# Altium schematic sheet Sheet1.SchDoc
size A4; SheetNumber: 1; SheetTotal: 1; SPICEModelCacheLHBWUHTN: <root> / <DocumentId>LHBWUHTN</DocumentId> / </root>
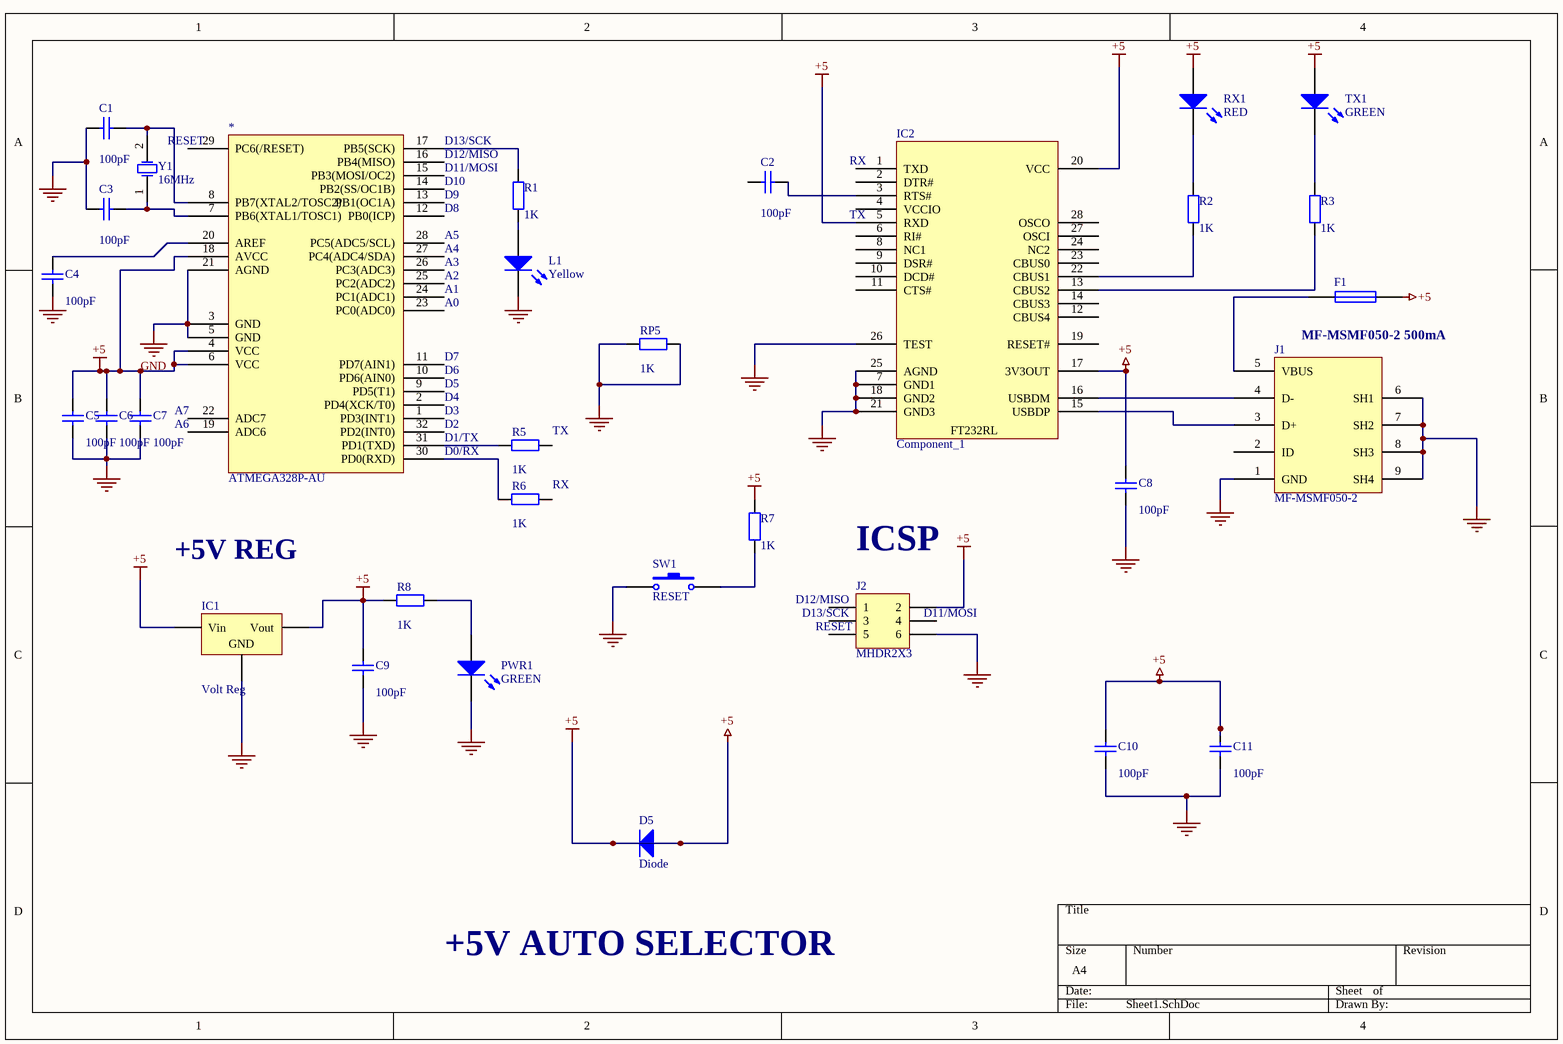
[diagram p0: Sheet1.SchDoc]

## Parts
*  ATMEGA328P-AU  [SOIC127P980X95_HS-33N]
C1  value 100pF  [RAD-0.3]  (hidden comment: Cap)
C2  value 100pF  [RAD-0.3]  (hidden comment: Cap)
C3  value 100pF  [RAD-0.3]  (hidden comment: Cap)
C4  value 100pF  [RAD-0.3]  (hidden comment: Cap)
C5  value 100pF  [RAD-0.3]  (hidden comment: Cap)
C6  value 100pF  [RAD-0.3]  (hidden comment: Cap)
C7  value 100pF  [RAD-0.3]  (hidden comment: Cap)
C8  value 100pF  [RAD-0.3]  (hidden comment: Cap)
C9  value 100pF  [RAD-0.3]  (hidden comment: Cap)
C10  value 100pF  [RAD-0.3]  (hidden comment: Cap)
C11  value 100pF  [RAD-0.3]  (hidden comment: Cap)
D5  Diode  [SMC]
F1  Fuse 1  [PIN-W2/E2.8]  (value not drawn)
IC1  Volt Reg  [D2PAK_N]
IC2  Component_1  [SOIC127P980X95_HS-29N]
J1  MF-MSMF050-2  [SOIC127P980X95_HS-10N]
J2  MHDR2X3  [MHDR2X3]
L1  Yellow  [3.2X1.6X1.1]
PWR1  GREEN  [3.2X1.6X1.1]
R1  value 1K  [AXIAL-0.4]  (hidden comment: Res2)
R2  value 1K  [AXIAL-0.4]  (hidden comment: Res2)
R3  value 1K  [AXIAL-0.4]  (hidden comment: Res2)
R5  value 1K  [AXIAL-0.4]  (hidden comment: Res2)
R6  value 1K  [AXIAL-0.4]  (hidden comment: Res2)
R7  value 1K  [AXIAL-0.4]  (hidden comment: Res2)
R8  value 1K  [AXIAL-0.4]  (hidden comment: Res2)
RP5  value 1K  [AXIAL-0.4]  (hidden comment: Res2)
RX1  RED  [3.2X1.6X1.1]
SW1  RESET  [SPST-2]
TX1  GREEN  [3.2X1.6X1.1]
Y1  16MHz  [R38]

## Nets
+5: *.4(VCC) *.6(VCC) *.18(AVCC) C5.2 C6.2 C7.2 C8.2 C9.2 C10.2 C11.2 D5.1(A) D5.2(K) F1.2 IC1.1(Vin) IC1.3(Vout) IC2.5(RXD) IC2.17(3V3OUT) IC2.20(VCC) J2.2 R7.2 R8.1 RX1.1(A) TX1.1(A)
GND: *.3(GND) *.5(GND) *.21(AGND) C1.1 C3.1 C4.1 C5.1 C6.1 C7.1 C8.1 C9.1 C10.1 C11.1 IC1.2(GND) IC2.7(GND1) IC2.18(GND2) IC2.21(GND3) IC2.25(AGND) IC2.26(TEST) J1.1(GND) J1.6(SH1) J1.7(SH2) J1.8(SH3) J1.9(SH4) J2.6 L1.2(K) PWR1.2(K) RP5.1 RP5.2 SW1.1
Net*_7: *.7(PB6(XTAL1/TOSC1)) C3.2 Y1.1(OSC1)
Net*_8: *.8(PB7(XTAL2/TOSC2)) C1.2 Y1.2(OSC2)
Net*_17: *.17(PB5(SCK)) R1.2
Net*_20: *.20(AREF) C4.2
Net*_30: *.30(PD0(RXD)) R6.2
Net*_31: *.31(PD1(TXD)) R5.2
NetC2_2: C2.2 IC2.3(RTS#)
NetF1_1: F1.1 J1.5(VBUS)
NetIC2_13: IC2.13(CBUS2) R3.1
NetIC2_15: IC2.15(USBDP) J1.3(D+)
NetIC2_16: IC2.16(USBDM) J1.4(D-)
NetIC2_22: IC2.22(CBUS1) R2.1
NetL1_1: L1.1(A) R1.1
NetPWR1_1: PWR1.1(A) R8.2
NetR2_2: R2.2 RX1.2(K)
NetR3_2: R3.2 TX1.2(K)
NetR7_1: R7.1 SW1.2

Not connected (* = marked no-connect by the designer): * 1(PD3(INT1)) 2(PD4(XCK/T0)) 9(PD5(T1)) 10(PD6(AIN0)) 11(PD7(AIN1)) 12(PB0(ICP)) 13(PB1(OC1A)) 14(PB2(SS/OC1B)) 15(PB3(MOSI/OC2)) 16(PB4(MISO)) 19(ADC6) 22(ADC7) 23(PC0(ADC0)) 24(PC1(ADC1)) 25(PC2(ADC2)) 26(PC3(ADC3)) 27(PC4(ADC4/SDA)) 28(PC5(ADC5/SCL)) 29(PC6(/RESET)) 32(PD2(INT0)); C2 1; IC2 1(TXD) 2(DTR#) 4(VCCIO) 6(RI#) 8(NC1) 9(DSR#) 10(DCD#) 11(CTS#) 12(CBUS4) 14(CBUS3) 19(RESET#) 23(CBUS0) 24(NC2) 27(OSCI) 28(OSCO); J1 2(ID); J2 1 3 4 5; R5 1; R6 1

## Notes on the sheet
- RESET
- D13/SCK
- D12/MISO
- D11/MOSI
- D10
- (near IC2) RX
- D9
- D8
- A5
- A4
- (near IC2) TX
- A3
- A2
- A1
- (near *) A0
- (near *) D7
- (near *) D6
- (near *) D5
- MF-MSMF050-2 500mA
- A6
- A7
- (near *) D4
- D3
- D2
- D1/TX
- D0/RX
- (near R5) TX
- (near R6) RX
- +5V REG
- (near J2) ICSP
- (near J2) D12/MISO
- (near J2) D13/SCK
- (near J2) RESET
- (near J2) D11/MOSI
- +5V AUTO SELECTOR
- (in symbol Component_1) FT232RL

## Library data of the parts
C1-C11 = Cap: Capacitor; Published: 8-Jun-2000; LatestRevisionDate: 17-Jul-2002; LatestRevisionNote: Re-released for DXP Platform.; PackageReference: RAD-0.3; Publisher: Altium Limited; PackageDescription: Radial Cap, Thru-Hole; 2 Leads; 0.3 in Pin Spacing
D5 = Diode: Default Diode; Published: 8-Jun-2000; LatestRevisionDate: 17-Jul-2002; LatestRevisionNote: Re-released for DXP Platform.; PackageVersion: Sep-1996; PackageReference: SMC; Publisher: Altium Limited; PackageDescription: DO-214-AB/SMC; 2 C-Bend Leads; Body 7.9 x 5.9 mm, inc. leads (LxW); Code_JEDEC: DO-214-AB
F1 = Fuse 1: Fuse; Published: 8-Jun-2000; LatestRevisionDate: 17-Jul-2002; LatestRevisionNote: Re-released for DXP Platform.; PackageReference: PIN-W2/E2.8; Publisher: Altium Limited; PackageDescription: Thru-Hole; 2 Leads
IC1 = Volt Reg: Voltage Regulator; Published: 24-Mar-1999; LatestRevisionDate: 29-May-2009; LatestRevisionNote: IPC-7351 Footprint Added.; PackageReference: D2PAK; Publisher: Altium Limited; PackageDescription: 3-Pin Transistor Outline Package 2.54 mm Pitch, 15.1 mm Lead Span
J2 = MHDR2X3: Header, 3-Pin, Dual row; LatestRevisionDate: 17-Jul-2002; LatestRevisionNote: Re-released for DXP Platform.; Publisher: Altium Limited
L1 PWR1 RX1 TX1 = LED2: Typical RED, GREEN, YELLOW, AMBER GaAs LED; Published: 8-Jun-2000; LatestRevisionDate: 17-Jul-2002; LatestRevisionNote: Re-released for DXP Platform.; PackageVersion: Feb-2002; PackageReference: 3.2X1.6X1.1; Publisher: Altium Limited; PackageDescription: SM LED; 2 Flat Leads
R1-R3 R5-R8 RP5 = Res2: Resistor; Published: 8-Jun-2000; LatestRevisionDate: 17-Jul-2002; LatestRevisionNote: Re-released for DXP Platform.; PackageReference: AXIAL-0.4; Publisher: Altium Limited; PackageDescription: Axial Device, Thru-Hole; 2 Leads; 0.4 in Pin Spacing
SW1 = SW-PB: Switch; Published: 24-Mar-1999; LatestRevisionDate: 17-Jul-2002; LatestRevisionNote: Re-released for DXP Platform.; PackageReference: SPST-2; Publisher: Altium Limited; PackageDescription: Switch; 2 Leads
Y1 = XTAL: Crystal Oscillator; Published: 8-Jun-2000; LatestRevisionDate: 17-Jul-2002; LatestRevisionNote: Re-released for DXP Platform.; PackageReference: R38; Publisher: Altium Limited; PackageDescription: Crystal, Thru-Hole; 2 Leads; Body 3.1 x 8.2 mm (Dia.xH)